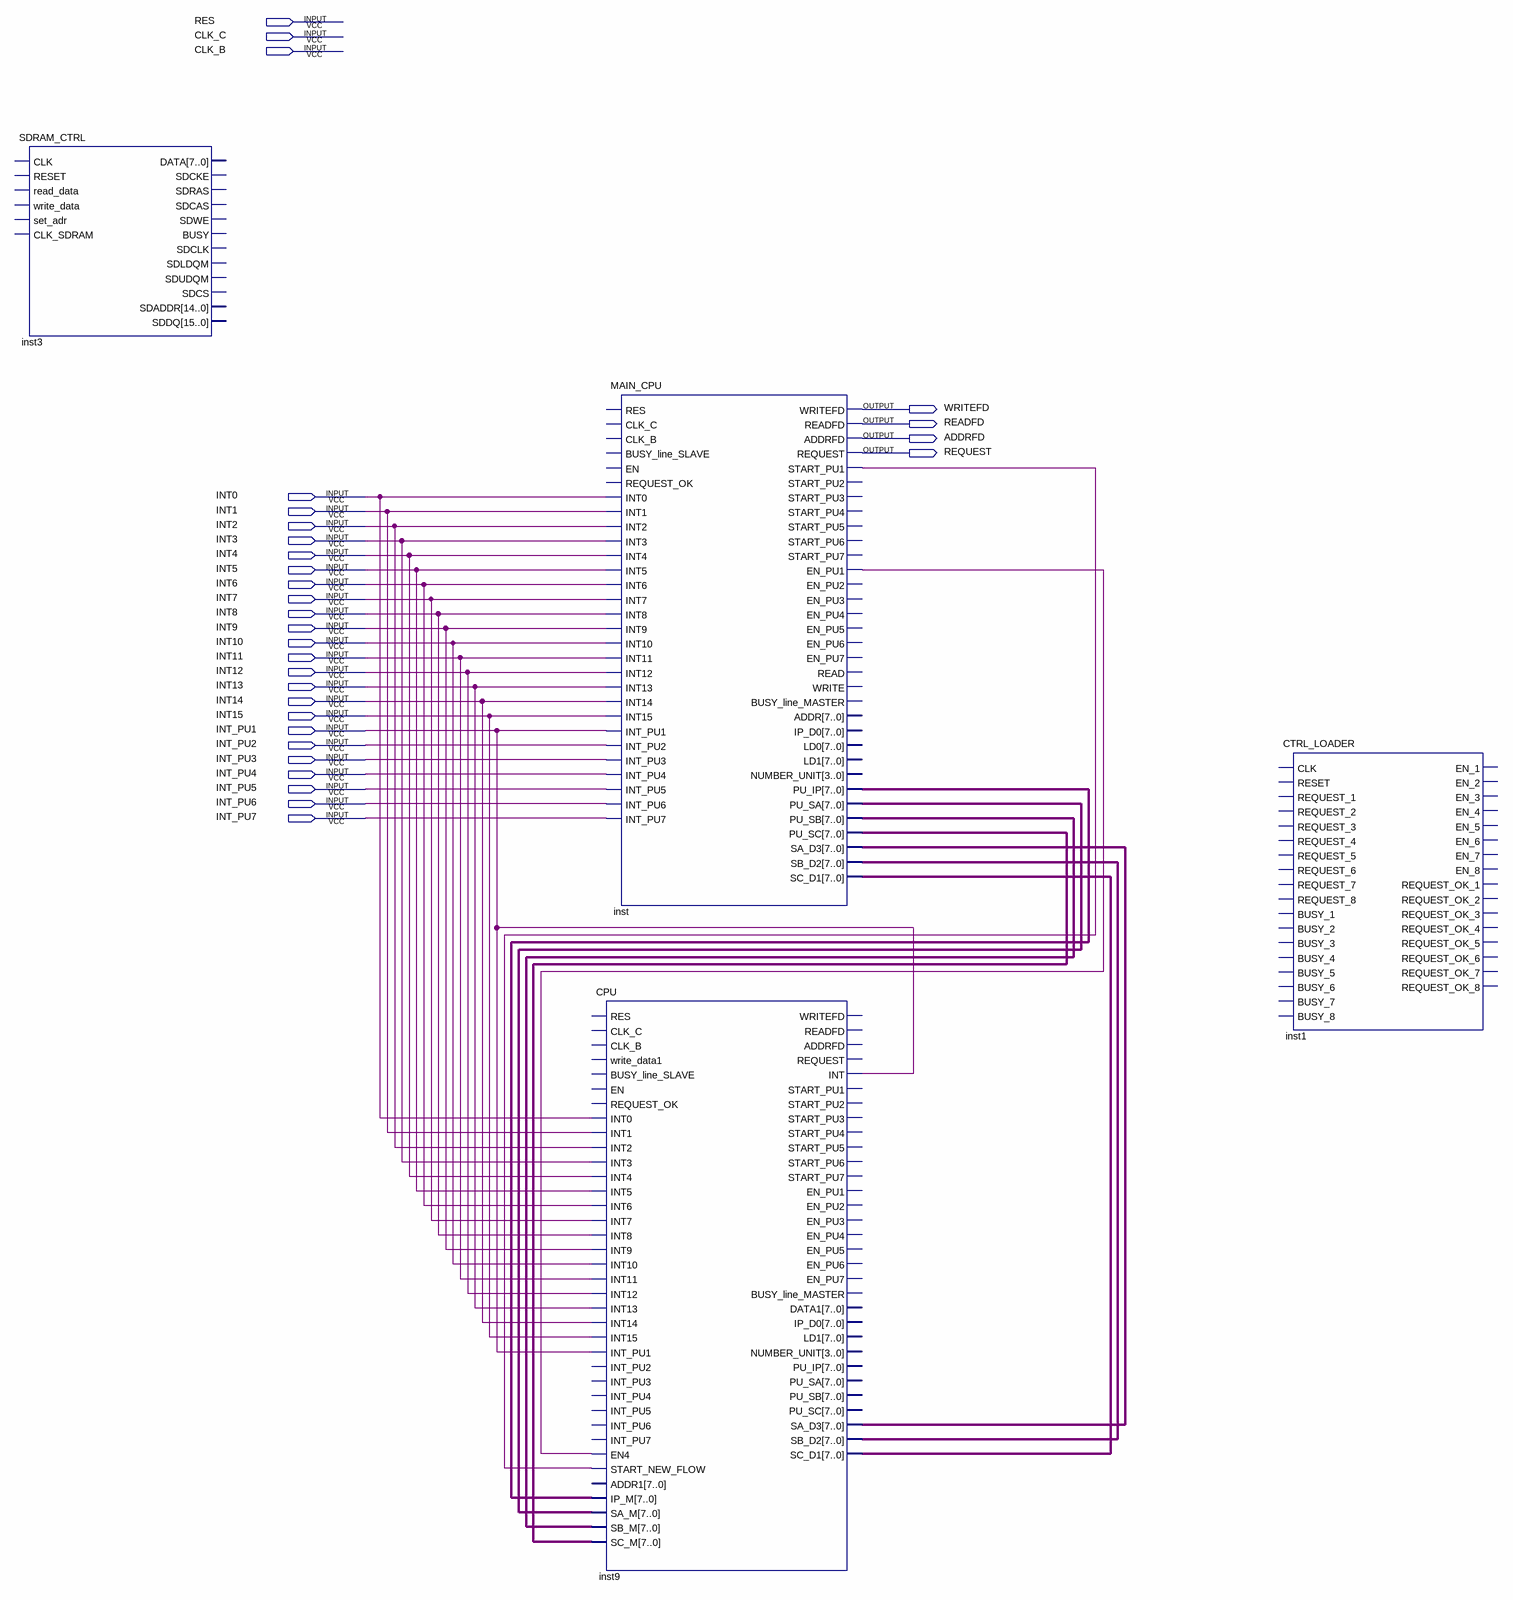
[diagram p0: schematic sheet]
// Quartus schematic MCPU_TOP8.bdf as structural Verilog: 4 symbols, 30 pins
module MCPU_TOP8 (
  input  RES,
  input  CLK_C,
  input  CLK_B,
  input  INT0,
  input  INT1,
  input  INT2,
  input  INT3,
  input  INT4,
  input  INT5,
  input  INT6,
  input  INT7,
  input  INT8,
  input  INT9,
  input  INT10,
  input  INT11,
  input  INT12,
  input  INT13,
  input  INT14,
  input  INT15,
  input  INT_PU1,
  input  INT_PU2,
  input  INT_PU3,
  input  INT_PU4,
  input  INT_PU5,
  input  INT_PU6,
  input  INT_PU7,
  output WRITEFD,
  output READFD,
  output ADDRFD,
  output REQUEST
);

  wire inst_en_pu1, inst_start_pu1;
  wire [7:0] inst_pu_ip, inst_pu_sa, inst_pu_sb, inst_pu_sc, inst_sa_d3, inst_sb_d2, inst_sc_d1;

  SDRAM_CTRL inst3 ();  // open: CLK, RESET, read_data, write_data, set_adr, CLK_SDRAM, SDCKE, SDRAS, SDCAS, SDWE, BUSY, SDCLK, SDLDQM, SDUDQM, SDCS, SDADDR, DATA, SDDQ
  MAIN_CPU inst (
    .INT0(INT0), .INT1(INT1), .INT2(INT2), .INT3(INT3), .INT4(INT4), .INT5(INT5), .INT6(INT6), .INT7(INT7),
    .INT8(INT8), .INT9(INT9), .INT10(INT10), .INT11(INT11), .INT12(INT12), .INT13(INT13), .INT14(INT14),
    .INT15(INT15), .INT_PU1(INT_PU1), .INT_PU2(INT_PU2), .INT_PU3(INT_PU3), .INT_PU4(INT_PU4),
    .INT_PU5(INT_PU5), .INT_PU6(INT_PU6), .INT_PU7(INT_PU7), .WRITEFD(WRITEFD), .READFD(READFD),
    .ADDRFD(ADDRFD), .REQUEST(REQUEST), .START_PU1(inst_start_pu1), .EN_PU1(inst_en_pu1), .PU_IP(inst_pu_ip),
    .PU_SA(inst_pu_sa), .PU_SB(inst_pu_sb), .PU_SC(inst_pu_sc), .SA_D3(inst_sa_d3), .SB_D2(inst_sb_d2),
    .SC_D1(inst_sc_d1));  // open: RES, CLK_C, CLK_B, BUSY_line_SLAVE, EN, REQUEST_OK, START_PU2, START_PU3, START_PU4, START_PU5, START_PU6, START_PU7, EN_PU2, EN_PU3, EN_PU4, EN_PU5, EN_PU6, EN_PU7, READ, WRITE, ADDR, NUMBER_UNIT, BUSY_line_MASTER, IP_D0, LD0, LD1
  CPU inst9 (
    .INT0(INT0), .INT1(INT1), .INT2(INT2), .INT3(INT3), .INT4(INT4), .INT5(INT5), .INT6(INT6), .INT7(INT7),
    .INT8(INT8), .INT9(INT9), .INT10(INT10), .INT11(INT11), .INT12(INT12), .INT13(INT13), .INT14(INT14),
    .INT15(INT15), .INT_PU1(INT_PU1), .EN4(inst_en_pu1), .START_NEW_FLOW(inst_start_pu1), .IP_M(inst_pu_ip),
    .SA_M(inst_pu_sa), .SB_M(inst_pu_sb), .SC_M(inst_pu_sc), .INT(INT_PU1), .SA_D3(inst_sa_d3),
    .SB_D2(inst_sb_d2), .SC_D1(inst_sc_d1));  // open: RES, CLK_C, CLK_B, write_data1, BUSY_line_SLAVE, EN, REQUEST_OK, INT_PU2, INT_PU3, INT_PU4, INT_PU5, INT_PU6, INT_PU7, ADDR1, WRITEFD, READFD, ADDRFD, REQUEST, START_PU1, START_PU2, START_PU3, START_PU4, START_PU5, START_PU6, START_PU7, EN_PU1, EN_PU2, EN_PU3, EN_PU4, EN_PU5, EN_PU6, EN_PU7, NUMBER_UNIT, PU_IP, PU_SA, PU_SB, PU_SC, BUSY_line_MASTER, DATA1, IP_D0, LD1
  CTRL_LOADER inst1 ();  // open: CLK, RESET, REQUEST_1, REQUEST_2, REQUEST_3, REQUEST_4, REQUEST_5, REQUEST_6, REQUEST_7, REQUEST_8, BUSY_1, BUSY_2, BUSY_3, BUSY_4, BUSY_5, BUSY_6, BUSY_7, BUSY_8, EN_1, EN_2, EN_3, EN_4, EN_5, EN_6, EN_7, EN_8, REQUEST_OK_1, REQUEST_OK_2, REQUEST_OK_3, REQUEST_OK_4, REQUEST_OK_5, REQUEST_OK_6, REQUEST_OK_7, REQUEST_OK_8
endmodule
